# Altium schematic sheet Sheet1.SchDoc
size A; SheetNumber: 1; SheetTotal: 1
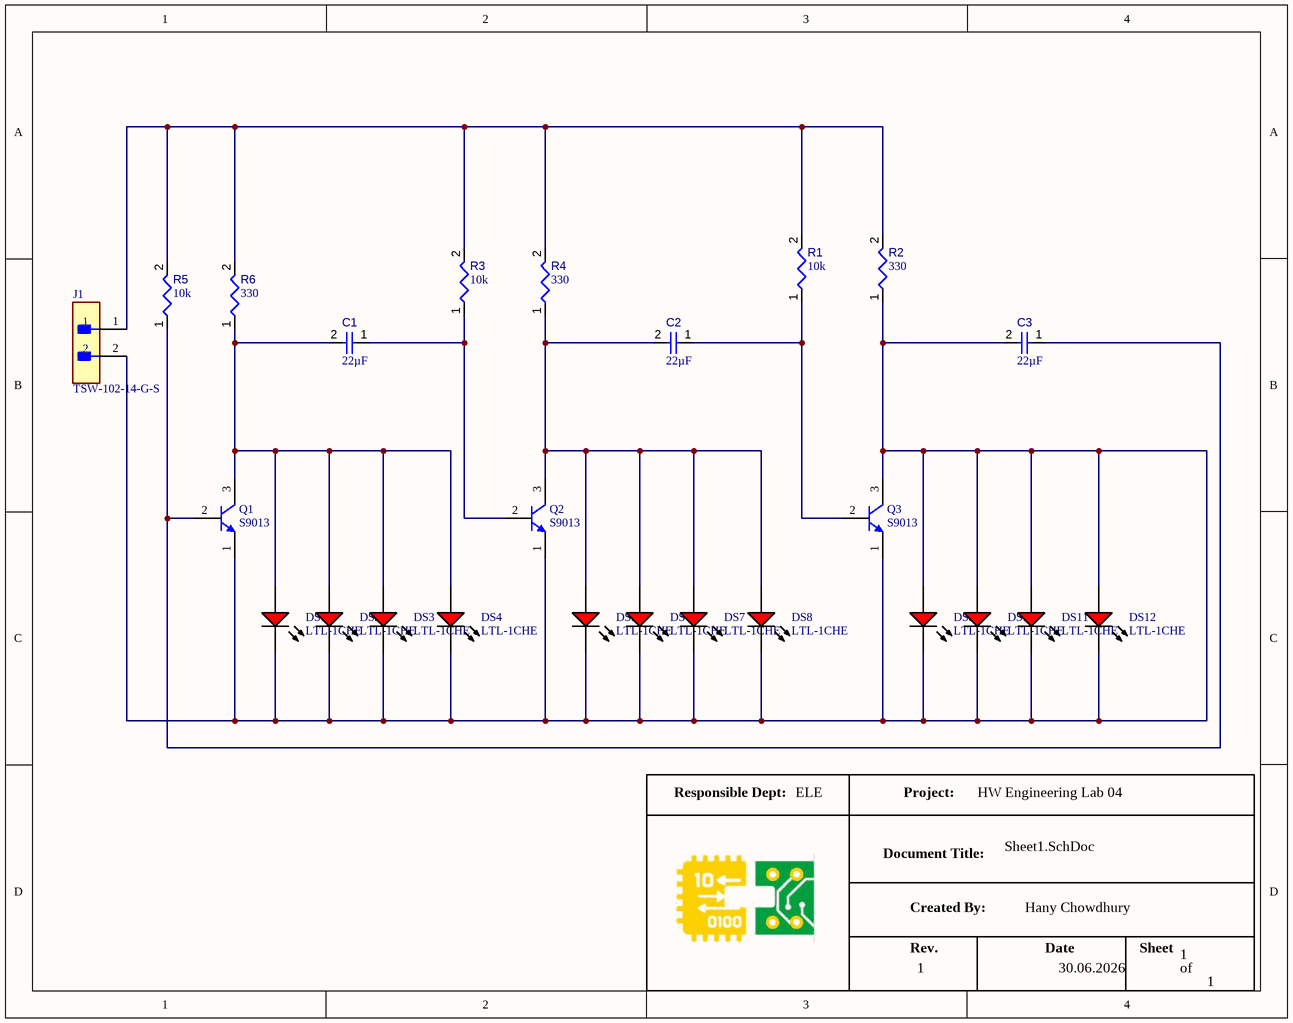
[diagram p0: Sheet1.SchDoc]

## Parts
C1  value 22µF  [CAPC0805(2012)145_L]  (hidden comment: Capacitor 22µF +/-40% 16V 0805)
C2  value 22µF  [CAPC0805(2012)145_L]  (hidden comment: Capacitor 22µF +/-40% 16V 0805)
C3  value 22µF  [CAPC0805(2012)145_L]  (hidden comment: Capacitor 22µF +/-40% 16V 0805)
DS1  LTL-1CHE  [INDPR60-254-520X380X650]
DS2  LTL-1CHE  [INDPR60-254-520X380X650]
DS3  LTL-1CHE  [INDPR60-254-520X380X650]
DS4  LTL-1CHE  [INDPR60-254-520X380X650]
DS5  LTL-1CHE  [INDPR60-254-520X380X650]
DS6  LTL-1CHE  [INDPR60-254-520X380X650]
DS7  LTL-1CHE  [INDPR60-254-520X380X650]
DS8  LTL-1CHE  [INDPR60-254-520X380X650]
DS9  LTL-1CHE  [INDPR60-254-520X380X650]
DS10  LTL-1CHE  [INDPR60-254-520X380X650]
DS11  LTL-1CHE  [INDPR60-254-520X380X650]
DS12  LTL-1CHE  [INDPR60-254-520X380X650]
J1  TSW-102-14-G-S  [FP-TSW-102-14-G-S-MFG]
Q1  S9013  [JSCJ-TO-92-3_V]
Q2  S9013  [JSCJ-TO-92-3_V]
Q3  S9013  [JSCJ-TO-92-3_V]
R1  value 10k  [RESA60-630X240]  (hidden comment: MFR-25FBF52-10K)
R2  value 330  [RESC0402(1005)_L]  (hidden comment: Resistor 330R +/-5 % 0402 63 mW)
R3  value 10k  [RESA60-630X240]  (hidden comment: MFR-25FBF52-10K)
R4  value 330  [RESC0402(1005)_L]  (hidden comment: Resistor 330R +/-5 % 0402 63 mW)
R5  value 10k  [RESA60-630X240]  (hidden comment: MFR-25FBF52-10K)
R6  value 330  [RESC0402(1005)_L]  (hidden comment: Resistor 330R +/-5 % 0402 63 mW)

## Nets
NetC1_1: C1.1 Q2.2(B) R3.1
NetC1_2: C1.2 DS1.1(A) DS2.1(A) DS3.1(A) DS4.1(A) Q1.3(C) R6.1
NetC2_1: C2.1 Q3.2(B) R1.1
NetC2_2: C2.2 DS5.1(A) DS6.1(A) DS7.1(A) DS8.1(A) Q2.3(C) R4.1
NetC3_1: C3.1 Q1.2(B) R5.1
NetC3_2: C3.2 DS1.2(K) DS2.2(K) DS3.2(K) DS4.2(K) DS5.2(K) DS6.2(K) DS7.2(K) DS8.2(K) DS9.1(A) DS9.2(K) DS10.1(A) DS10.2(K) DS11.1(A) DS11.2(K) DS12.1(A) DS12.2(K) J1.2 Q1.1(E) Q2.1(E) Q3.1(E) Q3.3(C) R2.1
NetJ1_1: J1.1 R1.2 R2.2 R3.2 R4.2 R5.2 R6.2

## Notes on the sheet
- Responsible Dept:
- ELE
- Project:
- HW Engineering Lab 04
- Document Title:
- Created By:
- Sheet1.SchDoc
- Hany Chowdhury
- Rev.
- 1
- Date
- 30.06.2026
- Sheet
- of

## Library data of the parts
C1-C3 = CMP-001-00081-4: Chip Capacitor, 22µF +/-40%, 16V, 0805, Thickness 1.45 mm; Tolerance: 5%; Voltage Rating: 16V; Mounting Technology: SMT; Pins: 2; Max Operating Temperature: 85°C; Case/Package: 0805; Min Operating Temperature: -55°C
DS1-DS12 = CMP-007-00018-2: LED Uni-Color Red, 100 mW, 30 mA, -55 to 100 degC, 2-Pin THD, RoHS, Bulk; Manufacturer: Lite-On; Forward Current: 20mA; Nominal Vf: 2V; Viewing Angle: 60degrees; Luminous Intensity: 12.6mcd; Lens Style: Dome; Pins: 2; RoHS Compliant: True; Package Reference: LTL-1CHE; Package Quantity: 1000; Mounting Technology: TH; Min Operating Temperature: -55°C; Colour: Red; Case/Package: Radial; Manufacturer URL: http://www.us.liteon.com/; Datasheet URL: https://datasheet.ciiva.com/15117/getdatasheetpartid-187746-15117985.pdf; Forward Voltage: 2V; Max Operating Temperature: 100°C; Illumination Colour: Red; Package Description: 2-Pin Through Hole Device, Dia 3.8 mm, Pitch 2.54 mm; Packaging: Bulk; Datasheet Version: Dec-03
J1 = CMP-002-00071-1: TSW - Samtec 2.54mm Pin Header 13.46mm Overall Pin Length 2.79mm Tail (14) - Fast Stock(mcv); Connector Type: Male Pin; Gender: Male; Max Current Rating: 7.6A; Mounting Technology: Through Hole; Max Operating Temperature: 125°C; Min Operating Temperature: -55°C; Pins: 2
Q1-Q3 = CMP-013-00000-3: Transistor, NPN, 0.1 uA, 150 MHz, 3-Pin TO-92; Manufacturer: Jiangsu Changjiang Electronics Technology; Case/Package: TO-92-3; Datasheet URL: http://www.cj-elec.com/txUpfile/20121910315050632.pdf; Datasheet Version: Rev. B, 11/2011; Package Description: 3-Pin Through Hole Device, Height 4.7 mm, Pitch 2.3 mm; Mounting Technology: TH; RoHS Compliant: False; Package Reference: TO-92-3
R1 R3 R5 = CMP-009-00047-4: Axial Resistor, 10 KOhm, +/- 1%, 0.25 W, -55 to 155 degC, 2-Pin THD, RoHS, Bulk; Manufacturer: Yageo; Power: 250mW; Voltage Rating: 250V; Manufacturer URL: http://www.yageo.com/; Datasheet URL: http://www.yageo.com/documents/recent/Yageo%20LR_MFR_2013.pdf; Package Reference: MFR-25; Min Operating Temperature: -55°C; Mounting Technology: TH; Package Quantity: 200; Case/Package: Axial; Tolerance: 1%; RoHS Compliant: True; Datasheet Version: Apr-13; Packaging: Bulk; Max Operating Temperature: 155°C; Package Description: 2-Pin Axial Lead, Dia 2.4 mm, Body Length 6.3 mm
R2 R4 R6 = CMP-009-00132-3: Chip Resistor, 330 Ohms, +/-5 %, 63 mW, -55 to 155 degC, 0402; Power: 63mW; Tolerance: 5%; Pins: 2; Max Operating Temperature: 155°C; Min Operating Temperature: -55°C; Case/Package: 0402